# EAGLE design DIN-Rail-In_V103 (EAGLE 6.4)

## Sheet 1 of 2
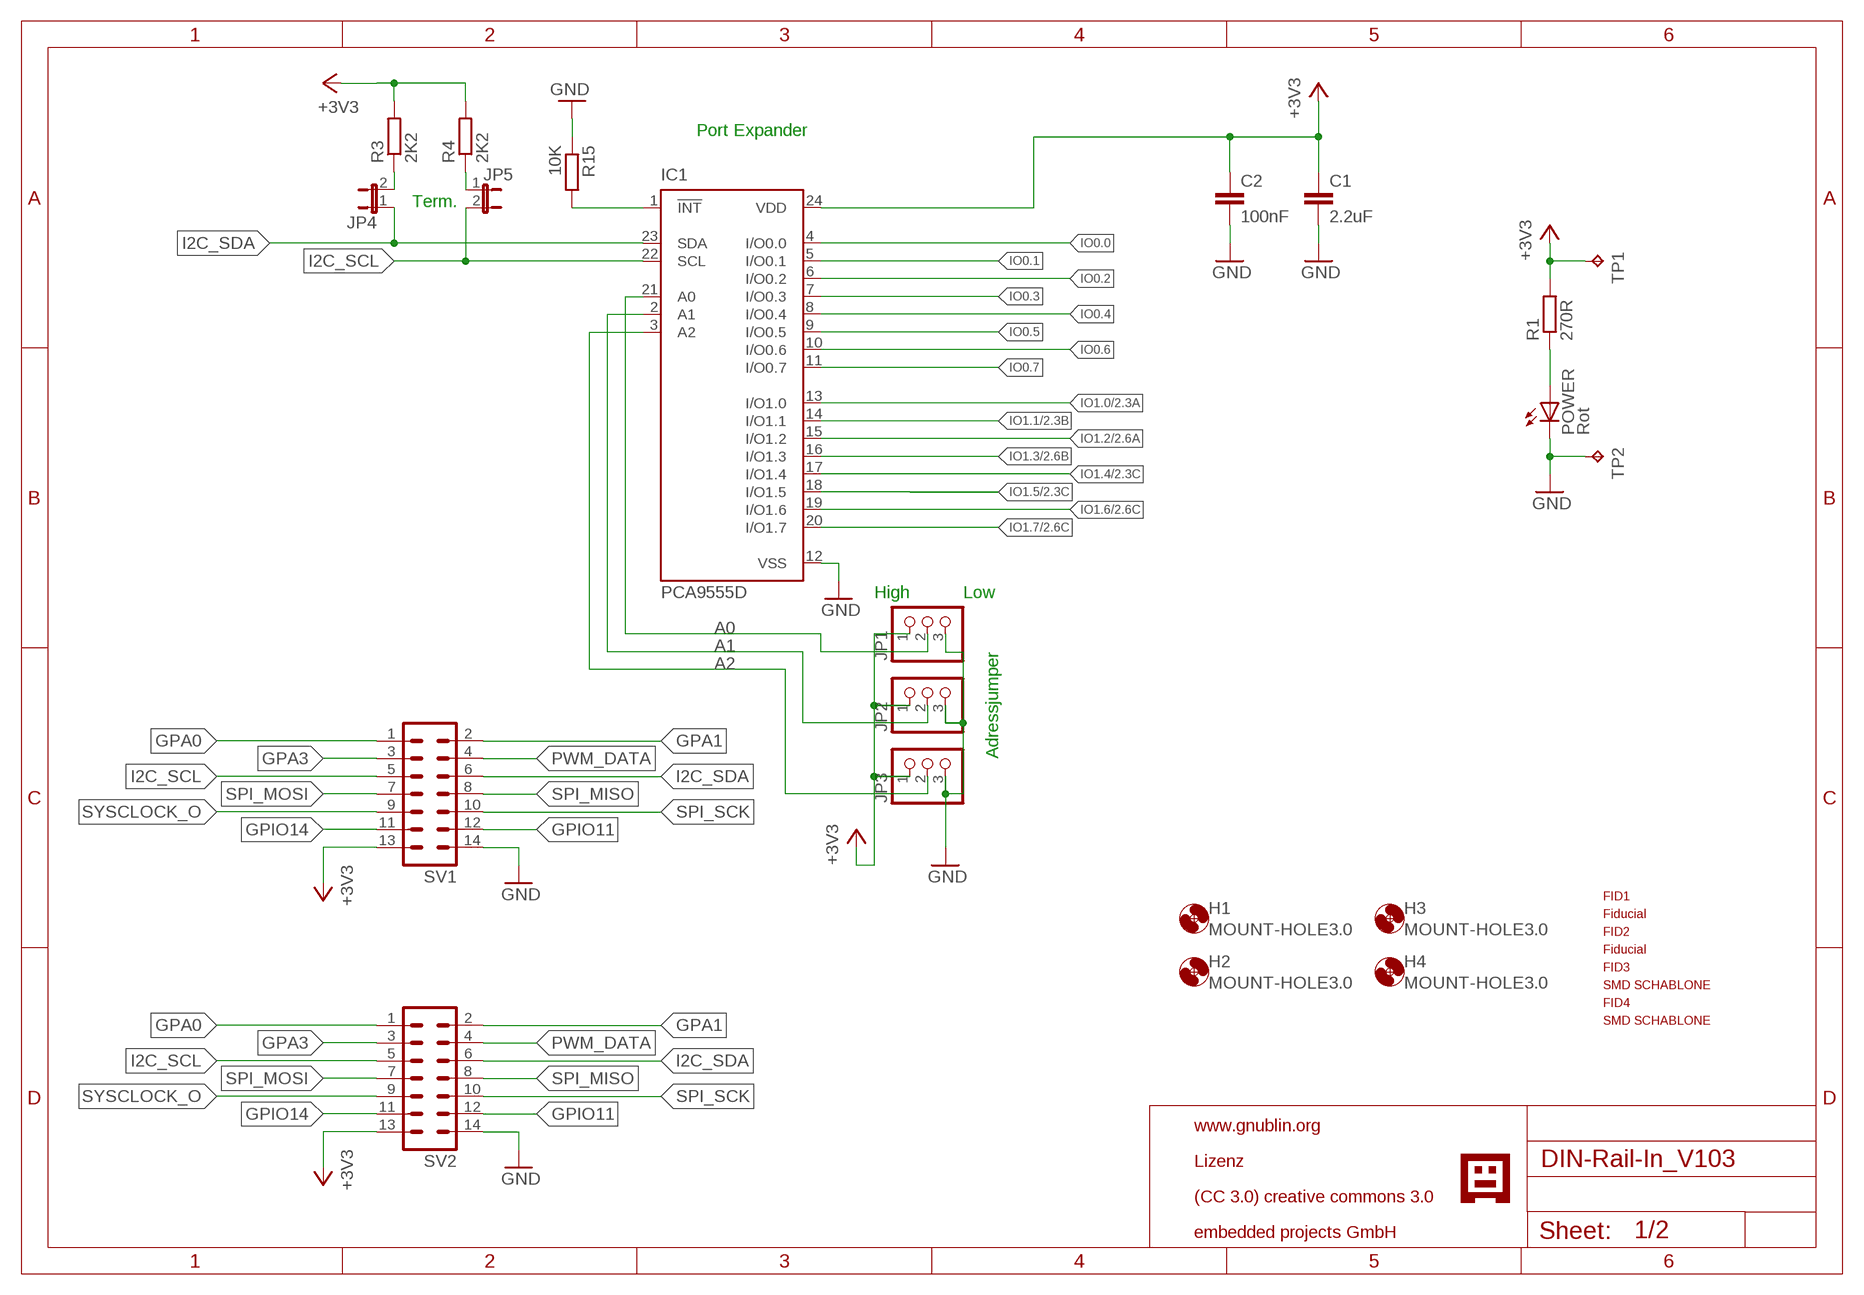
[diagram p0: schematic, sheet 1]

### Parts
C1  2.2uF  C-EUC0805  [C0805]
C2  100nF  C-EUC0805  [C0805]
FID1  PASSERMARKEN_FIDUCIAL  [PASSERMARKEN_FIDUCIAL]
FID2  PASSERMARKEN_FIDUCIAL  [PASSERMARKEN_FIDUCIAL]
FID3  PASSERMARKEN_FIDUCIAL  [PASSERMARKEN_FIDUCIAL]
FID4  PASSERMARKEN_FIDUCIAL  [PASSERMARKEN_FIDUCIAL]
H1  MOUNT-HOLE3.0  [3,0]
H2  MOUNT-HOLE3.0  [3,0]
H3  MOUNT-HOLE3.0  [3,0]
H4  MOUNT-HOLE3.0  [3,0]
IC1  PCA9555D  [SO24]
JP1  PINHD-1X3  [1X03]
JP2  PINHD-1X3  [1X03]
JP3  PINHD-1X3  [1X03]
JP4  JP1E  [JP1]
JP5  JP1E  [JP1]
POWER  Rot  LEDCHIP-LED0805  [CHIP-LED0805]
R1  270R  R-EU_R0805  [R0805]
R3  2K2  R-EU_R0805  [R0805]
R4  2K2  R-EU_R0805  [R0805]
R15  10K  R-EU_R0805  [R0805]
SV1  ML14  [ML14]
SV2  ML14  [ML14]
TP1  TPB1,27  [B1,27]
TP2  TPB1,27  [B1,27]
U$2  GNUBLINLOGOSIEB  [GNUSIEBDRUCK]

### Nets
!INT: IC1.1(!INT) R15.2
+3V3: C1.1 C2.1 IC1.24(VDD) JP1.1 JP2.1 JP3.1 R1.2 R3.2 R4.2 SV1.13 SV2.13 TP1.TP ; also sheet 2
A0: IC1.21(A0) JP1.2
A1: IC1.2(A1) JP2.2
A2: IC1.3(A2) JP3.2
GND: C1.2 C2.2 IC1.12(VSS) JP1.3 JP2.3 JP3.3 POWER.C R15.1 SV1.14 SV2.14 TP2.TP ; also sheet 2
GPA0: SV1.1 SV2.1
GPA1: SV1.2 SV2.2
GPA3: SV1.3 SV2.3
GPIO11: SV1.12 SV2.12
GPIO14: SV1.11 SV2.11
I2C_SCL: IC1.22(SCL) JP5.2 SV1.5 SV2.5
I2C_SDA: IC1.23(SDA) JP4.1 SV1.6 SV2.6
IO0.0: IC1.4(I/O0.0)
IO0.1: IC1.5(I/O0.1)
IO0.2: IC1.6(I/O0.2)
IO0.3: IC1.7(I/O0.3)
IO0.4: IC1.8(I/O0.4)
IO0.5: IC1.9(I/O0.5)
IO0.6: IC1.10(I/O0.6)
IO0.7: IC1.11(I/O0.7)
IO1.0: IC1.13(I/O1.0) ; also sheet 2
IO1.1: IC1.14(I/O1.1) ; also sheet 2
IO1.2: IC1.15(I/O1.2) ; also sheet 2
IO1.3: IC1.16(I/O1.3) ; also sheet 2
IO1.4: IC1.17(I/O1.4) ; also sheet 2
IO1.5: IC1.18(I/O1.5) ; also sheet 2
IO1.6: IC1.19(I/O1.6) ; also sheet 2
IO1.7: IC1.20(I/O1.7) ; also sheet 2
N$1: JP4.2 R3.1
N$2: POWER.A R1.1
N$5: JP5.1 R4.1
PWM_DATA: SV1.4 SV2.4
SPI_MISO: SV1.8 SV2.8
SPI_MOSI: SV1.7 SV2.7
SPI_SCK: SV1.10 SV2.10
SYSCLOCK_O: SV1.9 SV2.9

### Notes on the sheet
- Port Expander
- Term.
- High | Low
- Adressjumper
- www.gnublin.org
- Lizenz
- (CC 3.0) creative commons 3.0
- embedded projects GmbH

## Sheet 2 of 2
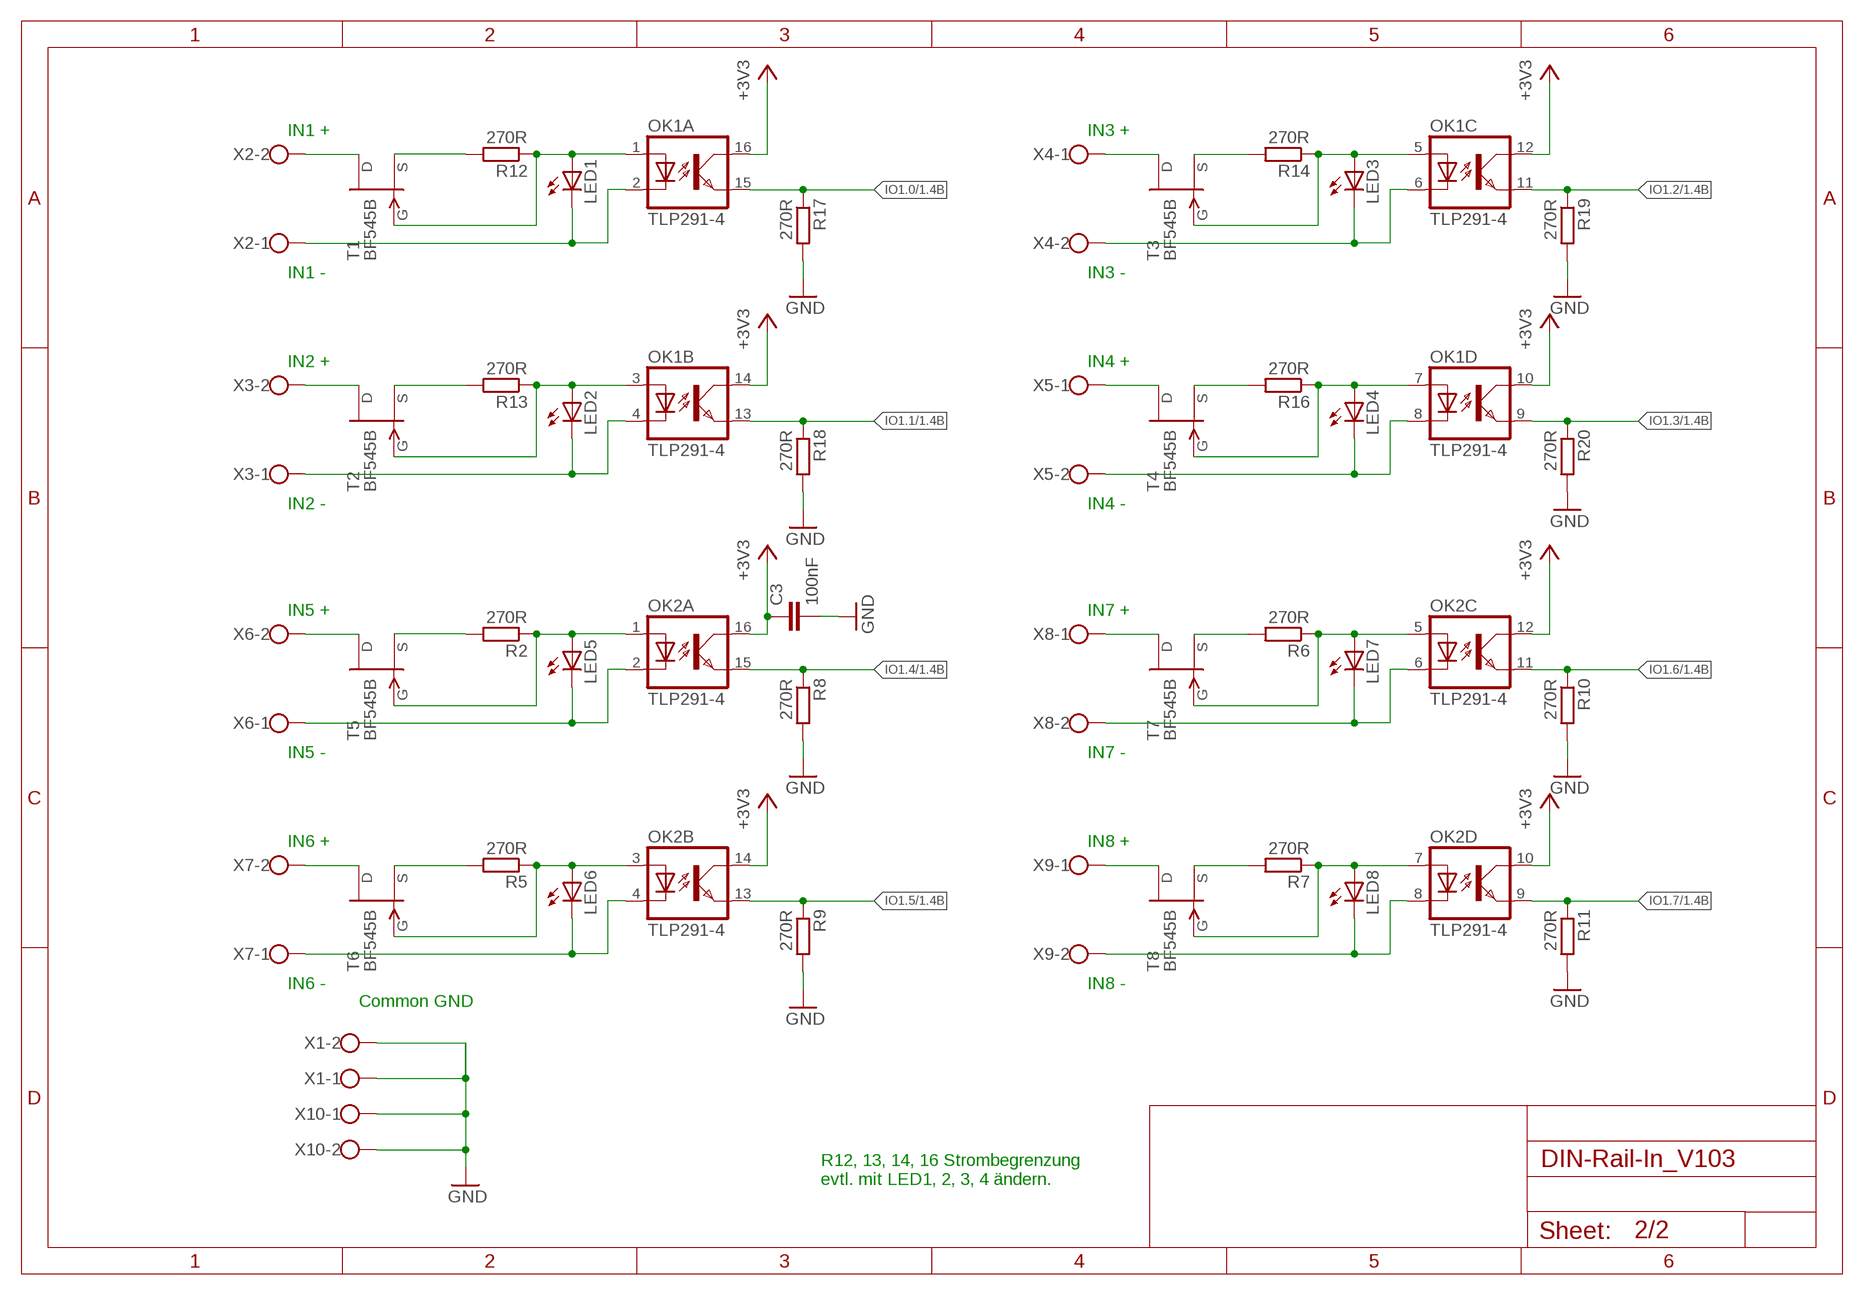
[diagram p1: schematic, sheet 2]

### Parts
C3  100nF  C-EUC0805  [C0805]
LED1  LEDCHIPLED_0805  [CHIPLED_0805]
LED2  LEDCHIPLED_0805  [CHIPLED_0805]
LED3  LEDCHIPLED_0805  [CHIPLED_0805]
LED4  LEDCHIPLED_0805  [CHIPLED_0805]
LED5  LEDCHIPLED_0805  [CHIPLED_0805]
LED6  LEDCHIPLED_0805  [CHIPLED_0805]
LED7  LEDCHIPLED_0805  [CHIPLED_0805]
LED8  LEDCHIPLED_0805  [CHIPLED_0805]
OK1  TLP291-4  TLP283-4  [MINI-FLAT-16]
OK2  TLP291-4  TLP283-4  [MINI-FLAT-16]
R2  270R  R-EU_R0805  [R0805]
R5  270R  R-EU_R0805  [R0805]
R6  270R  R-EU_R0805  [R0805]
R7  270R  R-EU_R0805  [R0805]
R8  270R  R-EU_R0805  [R0805]
R9  270R  R-EU_R0805  [R0805]
R10  270R  R-EU_R0805  [R0805]
R11  270R  R-EU_R0805  [R0805]
R12  270R  R-EU_R0805  [R0805]
R13  270R  R-EU_R0805  [R0805]
R14  270R  R-EU_R0805  [R0805]
R16  270R  R-EU_R0805  [R0805]
R17  270R  R-EU_R0805  [R0805]
R18  270R  R-EU_R0805  [R0805]
R19  270R  R-EU_R0805  [R0805]
R20  270R  R-EU_R0805  [R0805]
T1  BF545B  [SOT-23]
T2  BF545B  [SOT-23]
T3  BF545B  [SOT-23]
T4  BF545B  [SOT-23]
T5  BF545B  [SOT-23]
T6  BF545B  [SOT-23]
T7  BF545B  [SOT-23]
T8  BF545B  [SOT-23]
X1  W237-02P  [W237-132]
X2  W237-02P  [W237-132]
X3  W237-02P  [W237-132]
X4  W237-02P  [W237-132]
X5  W237-02P  [W237-132]
X6  W237-02P  [W237-132]
X7  W237-02P  [W237-132]
X8  W237-02P  [W237-132]
X9  W237-02P  [W237-132]
X10  W237-02P  [W237-132]

### Nets
+3V3: C3.1 OK1.10(D:COL) OK1.12(C:COL) OK1.14(B:COL) OK1.16(A:COL) OK2.10(D:COL) OK2.12(C:COL) OK2.14(B:COL) OK2.16(A:COL) ; also sheet 1
GND: C3.2 R8.2 R9.2 R10.2 R11.2 R17.2 R18.2 R19.2 R20.2 X1.1 X1.2 X10.1 X10.2 ; also sheet 1
IO1.0: OK1.15(A:EMIT) R17.1 ; also sheet 1
IO1.1: OK1.13(B:EMIT) R18.1 ; also sheet 1
IO1.2: OK1.11(C:EMIT) R19.1 ; also sheet 1
IO1.3: OK1.9(D:EMIT) R20.1 ; also sheet 1
IO1.4: OK2.15(A:EMIT) R8.1 ; also sheet 1
IO1.5: OK2.13(B:EMIT) R9.1 ; also sheet 1
IO1.6: OK2.11(C:EMIT) R10.1 ; also sheet 1
IO1.7: OK2.9(D:EMIT) R11.1 ; also sheet 1
N$3: T1.2(D) X2.2
N$4: LED1.A OK1.1(A:A) R12.1 T1.3(G)
N$6: T5.2(D) X6.2
N$7: T2.2(D) X3.2
N$8: LED2.A OK1.3(B:A) R13.1 T2.3(G)
N$9: LED5.A OK2.1(A:A) R2.1 T5.3(G)
N$10: LED1.C OK1.2(A:C) X2.1
N$11: T3.2(D) X4.1
N$12: LED3.A OK1.5(C:A) R14.1 T3.3(G)
N$13: T4.2(D) X5.1
N$14: LED4.A OK1.7(D:A) R16.1 T4.3(G)
N$15: T6.2(D) X7.2
N$16: LED2.C OK1.4(B:C) X3.1
N$17: LED6.A OK2.3(B:A) R5.1 T6.3(G)
N$18: LED3.C OK1.6(C:C) X4.2
N$19: LED4.C OK1.8(D:C) X5.2
N$20: R12.2 T1.1(S)
N$21: T7.2(D) X8.1
N$22: R13.2 T2.1(S)
N$23: LED7.A OK2.5(C:A) R6.1 T7.3(G)
N$24: R14.2 T3.1(S)
N$25: T8.2(D) X9.1
N$26: R16.2 T4.1(S)
N$27: LED8.A OK2.7(D:A) R7.1 T8.3(G)
N$28: LED5.C OK2.2(A:C) X6.1
N$29: LED6.C OK2.4(B:C) X7.1
N$30: LED7.C OK2.6(C:C) X8.2
N$31: LED8.C OK2.8(D:C) X9.2
N$32: R2.2 T5.1(S)
N$33: R5.2 T6.1(S)
N$34: R6.2 T7.1(S)
N$35: R7.2 T8.1(S)

### Notes on the sheet
- IN1 + | IN3 +
- IN1 - | IN3 -
- IN2 + | IN4 +
- IN2 - | IN4 -
- IN5 + | IN7 +
- IN5 - | IN7 -
- IN6 + | IN8 +
- IN6 - | IN8 -
- Common GND
- R12, 13, 14, 16 Strombegrenzung
  evtl. mit LED1, 2, 3, 4 ändern.

## Library data of the parts
C1-C3 = rcl:C-EU: CAPACITOR, European symbol
FID1 FID2 = KUBUS3:PASSERMARKEN_FIDUCIAL: SMD Passermarke
FID3 FID4 = SMDSCHABLONE:PASSERMARKEN_FIDUCIAL: SMD Passermarke
H1-H4 = holes:MOUNT-HOLE: MOUNTING HOLE with drill center marker
IC1 = micro-philips:PCA9555: 16-bit I2C and SMBus I/O port with interrupt Source: PCA9555_5.pdf; MPN: PCA9555DW; OC_FARNELL: 8906076; OC_NEWARK: 63K6067
JP1-JP3 = pinhead:PINHD-1X3: PIN HEADER
JP4 JP5 = jumper:JP1E: JUMPER
LED1-LED8 POWER = led:LED: LED OSRAM: - CHIPLED LG R971, LG N971, LY N971, LG Q971, LY Q971, LO R971, LY R971 LH N974, LH R974 LS Q976, LO Q976, LY Q976 LO Q996 - Hyper CHIPLED LW Q18S LB Q993, LB Q99A, LB R99A - SideLED LS A670, LO A670, LY A670, LG A670, LP A670 LB A673, LV A673, LT A673, LW A673 LH A674 LY A675 LS A676, LA A676, LO A676, LY A676, LW A676 LS A679, LY A679, LG A679 - Hyper Micro SIDELED® LS Y876, LA Y876, LO Y876, LY Y876 LT Y87S - SmartLED LW L88C, LW L88S LB L89C, LB L89S, LG L890 LS L89K, LO L89K, LY L89K LS L896, LA L896, LO L896, LY L896 - TOPLED LS T670, LO T670, LY T670, LG T670, LP T670 LSG T670, LSP T670, LSY T670, LOP T670, LYG T670 LG T671, LOG T671, LSG T671 LB T673, LV T673, LT T673, LW T673 LH T674 LS T676, LA T676, LO T676, LY T676, LB T676, LH T676, LSB T676, LW T676 LB T67C, LV T67C, LT T67C, LS T67K, LO T67K, LY T67K, LW E67C LS E67B, LA E67B, LO E67B, LY E67B, LB E67C, LV E67C, LT E67C LW T67C LS T679, LY T679, LG T679 LS T770, LO T770, LY T770, LG T770, LP T770 LB T773, LV T773, LT T773, LW T773 LH T774 LS E675, LA E675, LY E675, LS T675 LS T776, LA T776, LO T776, LY T776, LB T776 LHGB T686 LT T68C, LB T68C - Hyper Mini TOPLED® LB M676 - Mini TOPLED Santana® LG M470 LS M47K, LO M47K, LY M47K Source: http://www.osram.convergy.de LUXEON: - LUMILED® LXK2-PW12-R00, LXK2-PW12-S00, LXK2-PW14-U00, LXK2-PW14-V00 LXK2-PM12-R00, LXK2-PM12-S00, LXK2-PM14-U00 LXK2-PE12-Q00, LXK2-PE12-R00, LXK2-PE12-S00, LXK2-PE14-T00, LXK2-PE14-U00 LXK2-PB12-K00, LXK2-PB12-L00, LXK2-PB12-M00, LXK2-PB14-N00, LXK2-PB14-P00, LXK2-PB14-Q00 LXK2-PR12-L00, LXK2-PR12-M00, LXK2-PR14-Q00, LXK2-PR14-R00 LXK2-PD12-Q00, LXK2-PD12-R00, LXK2-PD12-S00 LXK2-PH12-R00, LXK2-PH12-S00 LXK2-PL12-P00, LXK2-PL12-Q00, LXK2-PL12-R00 Source: www.luxeon.com KINGBRIGHT: KA-3528ASYC Source: www.kingbright.com
OK1 OK2 = optocoupler:TLP283-4: TOSHIBA PHOTOCOUPLER GaAs IRED & PHOTO-TRANSISTOR Source: http://www.semicon.toshiba.co.jp/td/en/Opto/Photocoupler/en_20050928_TLP283_datasheet.pdf
R1-R20 = rcl:R-EU_: RESISTOR, European symbol
SV1 SV2 = con-ml:ML14: HARTING; OC_FARNELL: unknown; OC_NEWARK: unknown
T1-T8 = EmbeddedProjectsBauteile:BF545: JFET N-Channel; FARNELL: 1349656
TP1 TP2 = testpad:TP: Test pad
U$2 = EmbeddedProjectsLogos2:GNUBLINLOGO
X1-X10 = con-wago-508:W237-02P: WAGO SREW CLAMP

## Board
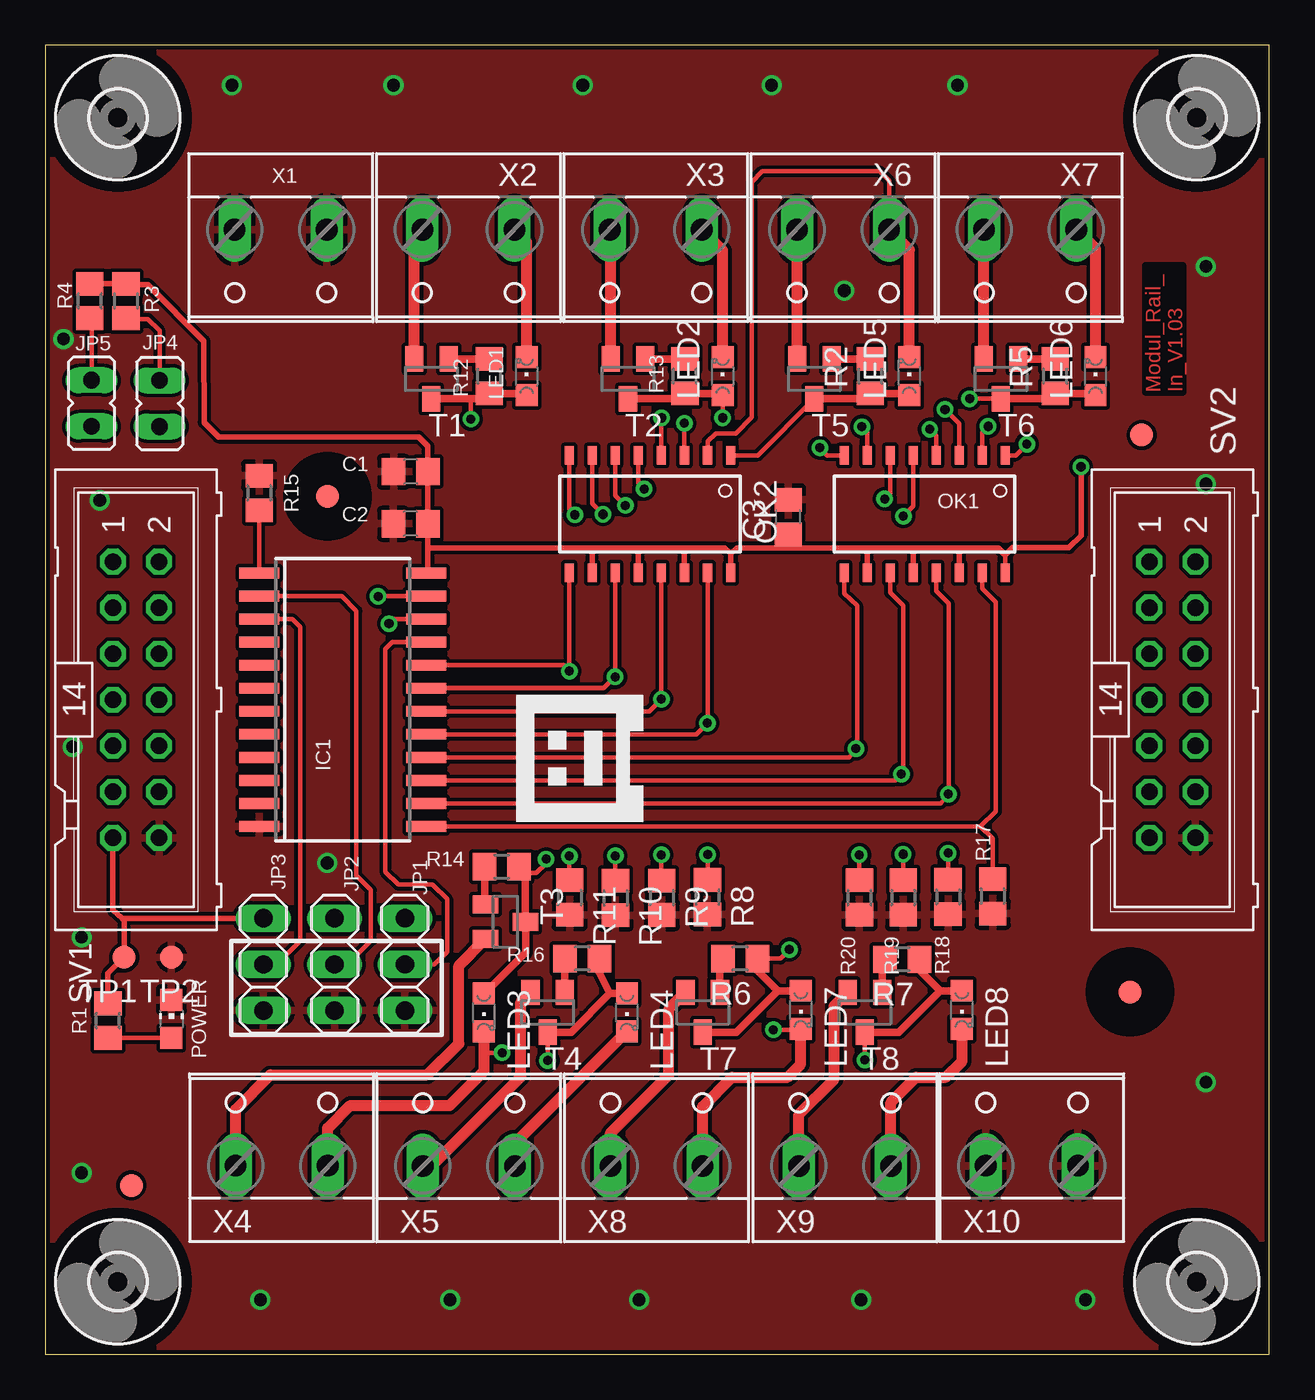
[diagram p2: board, top side]
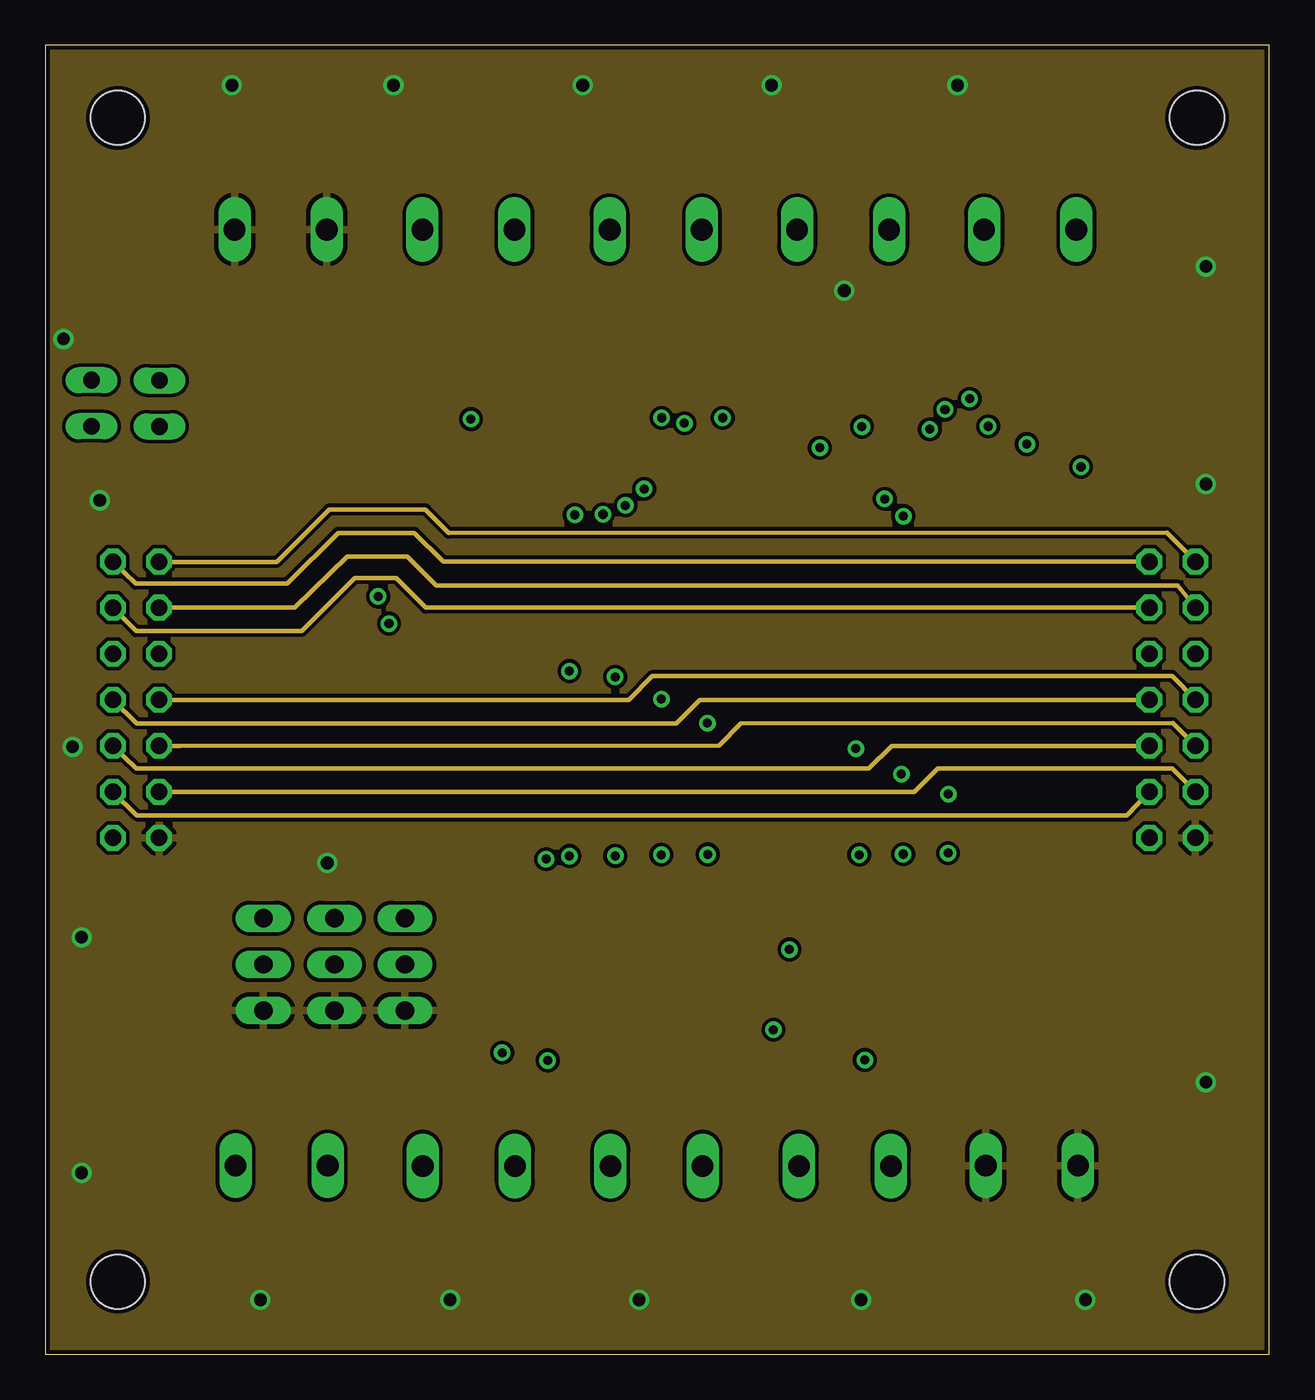
[diagram p3: board, inner layer Route2]
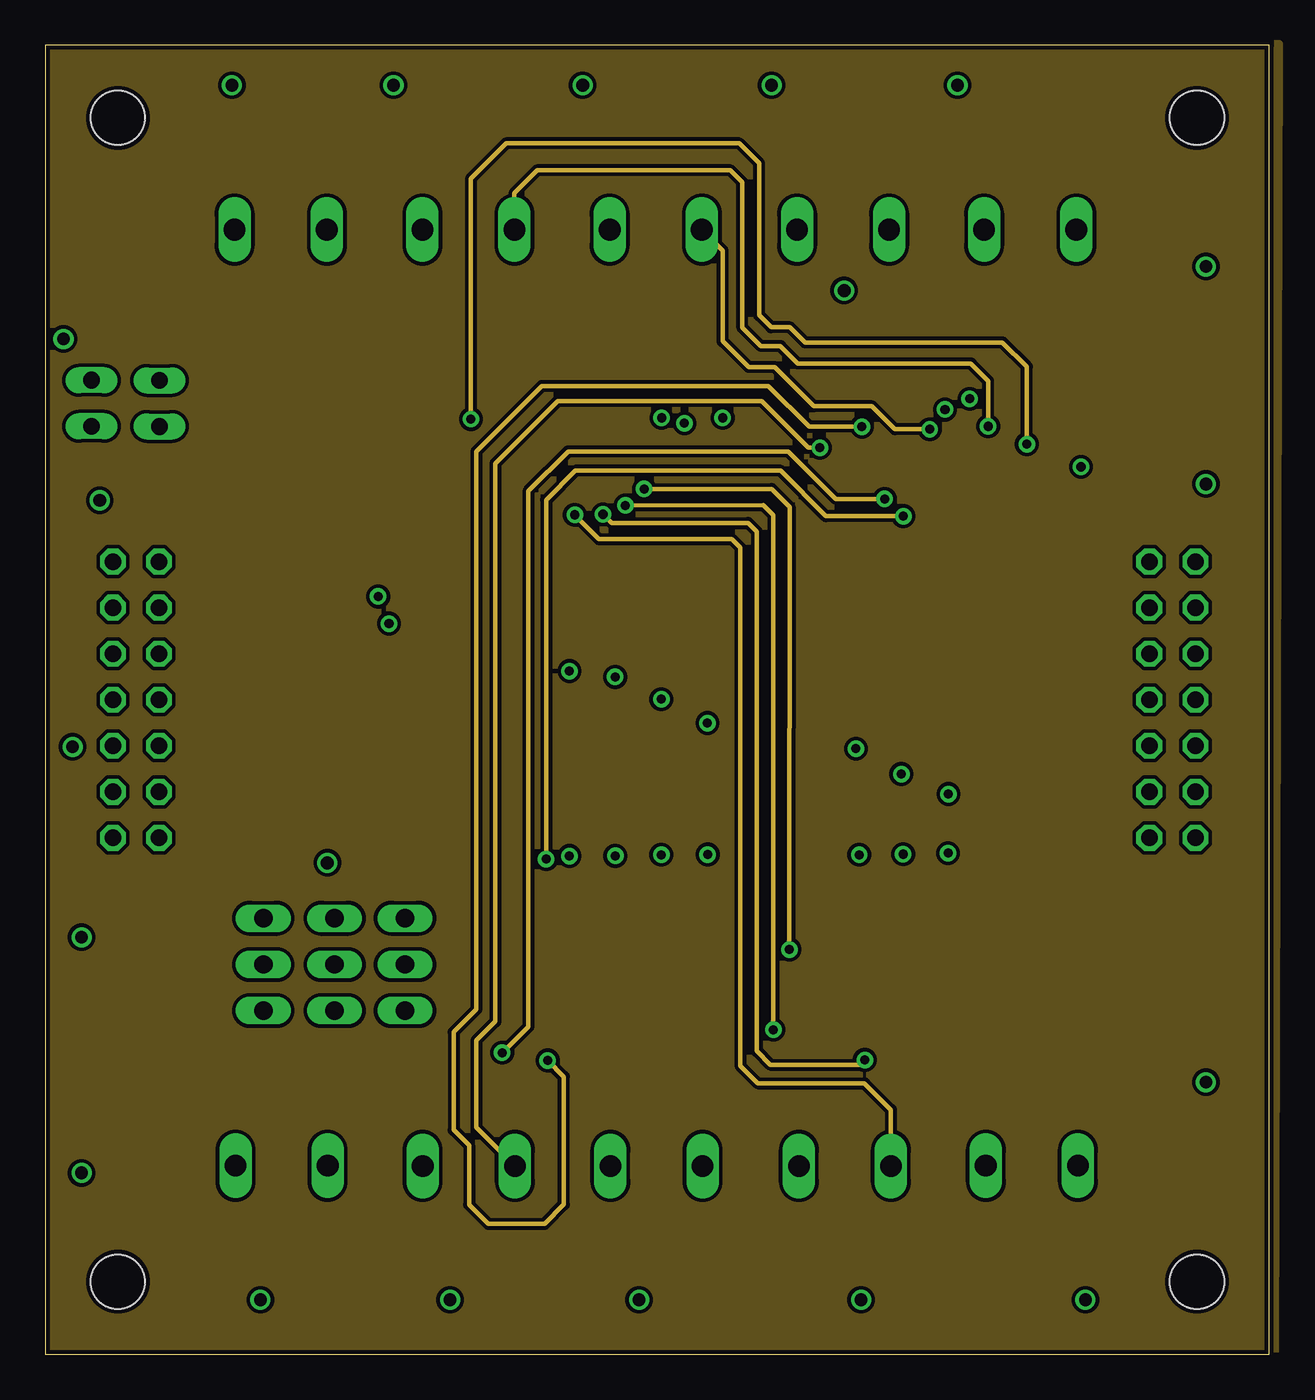
[diagram p4: board, inner layer Route15]
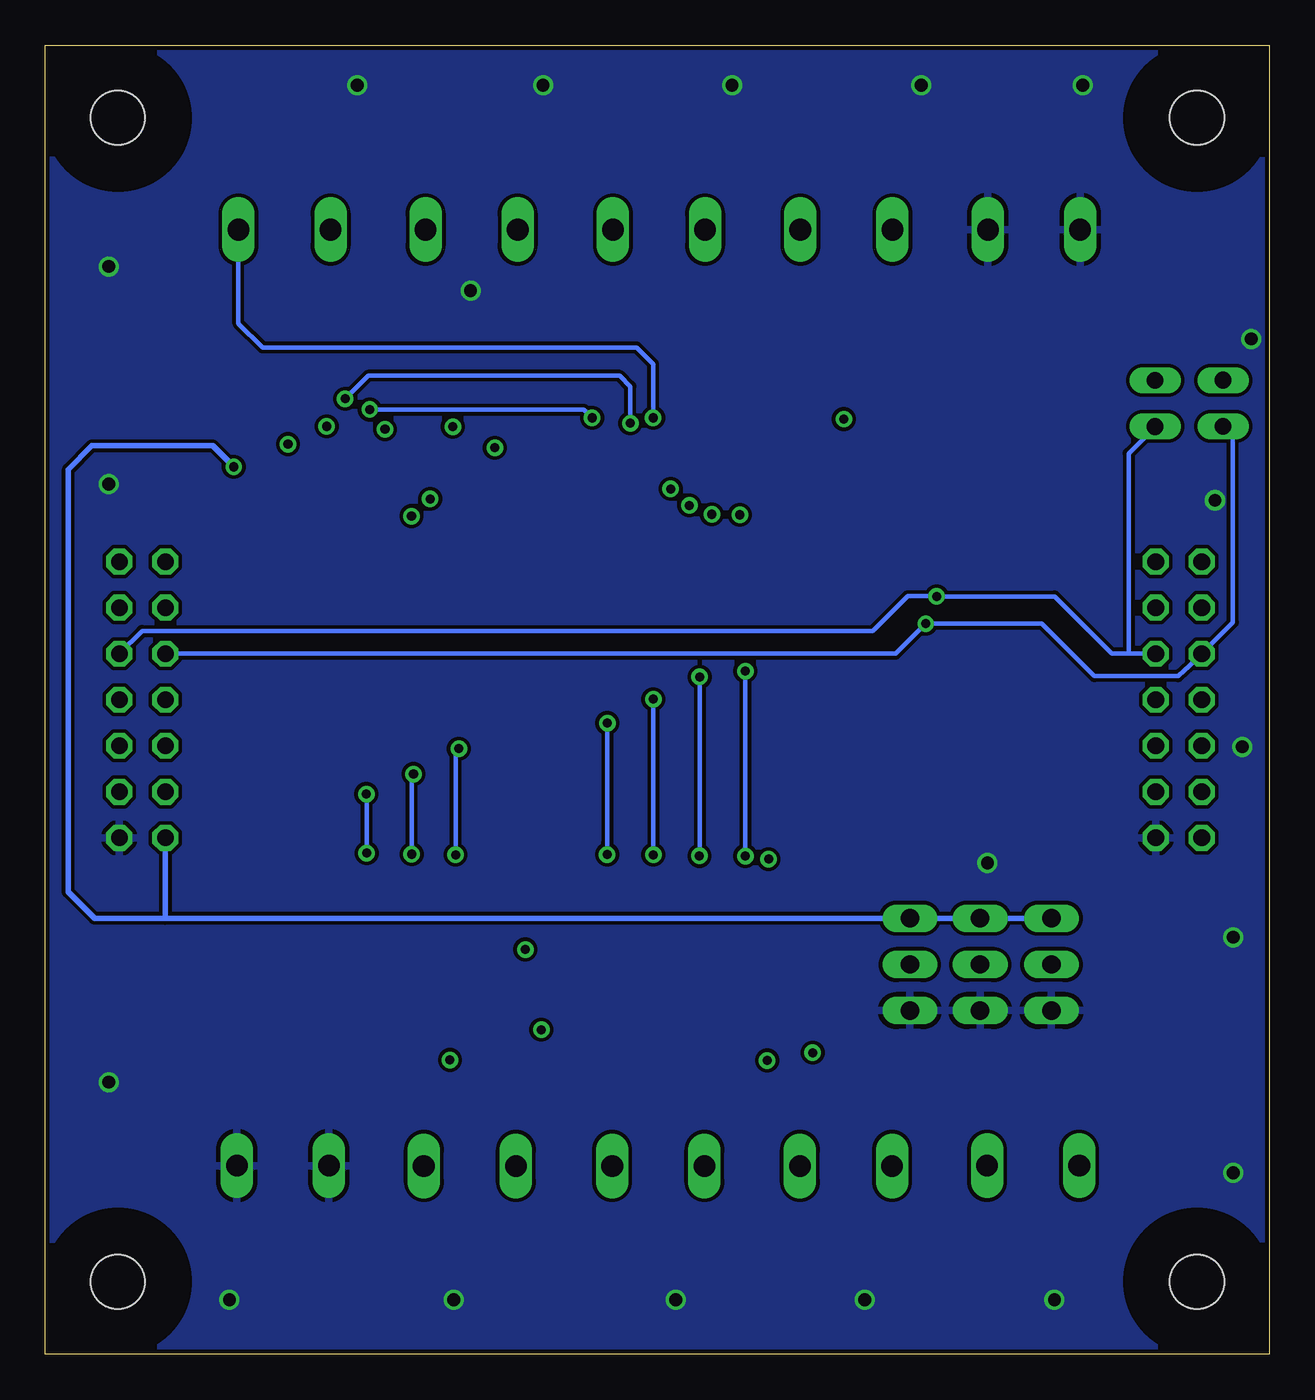
[diagram p5: board, bottom side, seen from below]

Size 67.5 x 72.2 mm. Coordinates in mm from the lower left corner, seen from the top.
Outline: 0,0 67.5,0 67.5,72.2 0,72.2 0,0
Copper layers (1*2+15*16): Top 0.035mm / dielectric 1.5mm / Route2 0.035mm / dielectric 0.15mm / Route15 0.035mm / dielectric 0.2mm / Bottom 0.035mm
Design rules "default *": minimum track width 10mil, minimum drill 24mil, track to track 8mil, track to pad 8mil, pad to pad 8mil, via to via 8mil, smd to smd 8mil, copper to edge 10mil, drill to drill 8mil, minimum pad ring 10mil, minimum via ring 8mil, stop-mask expansion 4mil, vias tented up to drill 40mil, thermal gap 10mil

### Footprints (pad centres in the part's own frame; a part is rotated, then mirrored left to right if it is on the bottom)
C0805 = smd 1.3 x 1.5: 1 -0.95,0; 2 0.95,0
PASSERMARKEN_FIDUCIAL = smd 1.27 x 1.27: 1 0,0
3,0 = hole 3: 0,0
SO24 = smd 0.6 x 2.2: 1 -6.985,-4.6; 2 -5.715,-4.6; 3 -4.445,-4.6; 4 -3.175,-4.6; 5 -1.905,-4.6; 6 -0.635,-4.6; 7 0.635,-4.6; 8 1.905,-4.6; 9 3.175,-4.6; 10 4.445,-4.6; 11 5.715,-4.6; 12 6.985,-4.6; 13 6.985,4.6; 14 5.715,4.6; 15 4.445,4.6; 16 3.175,4.6; 17 1.905,4.6; 18 0.635,4.6; 19 -0.635,4.6; 20 -1.905,4.6; 21 -3.175,4.6; 22 -4.445,4.6; 23 -5.715,4.6; 24 -6.985,4.6
1X03 = drill 1.016 long: 1 -2.54,0; 2 0,0; 3 2.54,0
JP1 = drill 0.914 long: 1 0,-1.27; 2 0,1.27
CHIPLED_0805 = smd 1.2 x 1.2: A 0,-1.05; C 0,1.05
MINI-FLAT-16 = smd 1 x 0.5: 1 -3.24,4.445; 2 -3.24,3.175; 3 -3.24,1.905; 4 -3.24,0.635; 5 -3.24,-0.635; 6 -3.24,-1.905; 7 -3.24,-3.175; 8 -3.24,-4.445; 9 3.24,-4.445; 10 3.24,-3.175; 11 3.24,-1.905; 12 3.24,-0.635; 13 3.24,0.635; 14 3.24,1.905; 15 3.24,3.175; 16 3.24,4.445
CHIP-LED0805 = smd 1.2 x 1.2: A 0,-1.05; C 0,1.05
R0805 = smd 1.3 x 1.5: 1 -0.95,0; 2 0.95,0
ML14 = drill 0.914 octagon: 1 -7.62,-1.27; 2 -7.62,1.27; 3 -5.08,-1.27; 4 -5.08,1.27; 5 -2.54,-1.27; 6 -2.54,1.27; 7 0,-1.27; 8 0,1.27; 9 2.54,-1.27; 10 2.54,1.27; 11 5.08,-1.27; 12 5.08,1.27; 13 7.62,-1.27; 14 7.62,1.27
SOT-23 = smd 1 x 1.4: 1 -0.95,-1.1; 2 0.95,-1.1; 3 0,1.1
B1,27 = smd 1.27 x 1.27: TP 0,0
W237-132 = drill 1.194 long: 1 -2.54,-0.635; 2 2.54,-0.635

### Placement (x,y rotation side)
C1  20.15,48.68 180 top
C2  20.14,45.81 180 top
C3  40.96,46.18 90 top
FID1  15.56,47.32 0 top
FID2  59.81,19.98 0 top
FID3  60.45,50.7 0 top
FID4  4.74,9.31 0 top
H1  4,4 0 top
H2  63.5,4 0 top
H3  63.5,68.2 0 top
H4  4,68.2 0 top
IC1  16.4,36.1 270 top
JP1  19.83,21.5 270 top
JP2  15.95,21.5 270 top
JP3  12.02,21.5 270 top
JP4  6.3,52.44 0 top
JP5  2.55,52.46 180 top
LED1  26.54,53.95 0 top
LED2  37.35,53.95 0 top
LED3  24.18,18.85 180 top
LED4  32.07,18.85 180 top
LED5  47.64,53.95 0 top
LED6  57.91,53.95 0 top
LED7  41.66,19 180 top
LED8  50.54,19 180 top
OK1  48.49,46.34 270 top
OK2  33.34,46.34 270 top
POWER  6.95,18.5 0 top
R1  3.45,18.4 90 top
R2  45.49,53.95 90 top
R3  4.45,58.1 90 top
R4  2.45,58.1 90 top
R5  55.69,53.95 90 top
R6  38.31,21.82 180 top
R7  47.25,21.78 180 top
R8  36.51,25.21 270 top
R9  33.99,25.18 270 top
R10  31.44,25.16 270 top
R11  28.91,25.19 270 top
R12  24.48,53.95 90 top
R13  35.27,53.95 90 top
R14  25.17,26.89 180 top
R15  11.79,47.51 270 top
R16  29.61,21.82 180 top
R17  52.24,25.26 270 top
R18  49.78,25.22 270 top
R19  47.3,25.19 270 top
R20  44.89,25.19 270 top
SV1  5,36.1 270 top
SV2  62.15,36.1 270 top
T1  21.29,53.8 180 top
T2  32.13,53.8 180 top
T3  25.37,23.85 270 top
T4  27.7,18.86 180 top
T5  42.41,53.8 180 top
T6  52.69,53.8 180 top
T7  36.25,18.86 180 top
T8  45.19,18.86 180 top
TP1  4.35,21.9 0 top
TP2  6.95,21.9 0 top
U$2  32.97,29.37 90 top
X1  12.98,61.4 180 top
X2  23.33,61.4 180 top
X3  33.66,61.4 180 top
X4  13.03,11.03 0 top
X5  23.35,11.02 0 top
X6  43.99,61.4 180 top
X7  54.31,61.4 180 top
X8  33.7,11.02 0 top
X9  44.09,11.02 0 top
X10  54.4,11.03 0 top

### Tracks (layer width: path | path; a pad name or v marks a point on that pad's centre or on a via)
!INT
  Top 0.254: IC1.1 R15.2
+3V3  (via drill 0.5)
  Top 0.254: 47.85,44.41 47.84,44.48 | 50.4,44.41 50.4,44.48 | 52.94,44.09 OK1.16 | 45.31,43.95 45.31,44 | 30.18,44.48 30.16,44.47 OK2.10 | 32.7,44.45 32.67,44.48 | 35.24,44.45 35.29,44.48 | 21.18,44.48 21.09,44.39 | 41,44.61 40.87,44.48 | 45.32,44.48 45.31,44.14 45.32,44.48
  Top 0.305: C1.1 21.1,46.4 C2.1 21.09,44.39 21.09,43.12 IC1.24 | 8.74,55.79 8.74,55.89 | 8.74,55.89 8.74,55.79 | 8.74,55.79 8.75,51.4 9.55,50.6 20.59,50.6 21.1,50.09 C1.1 | 21.11,48.72 C1.1 | JP3.1 4.25,24.04 | 4.25,24.04 4.23,24.05 3.73,24.52 3.73,24.97 SV1.13 | R1.2 3.45,21 TP1.TP 4.35,23.94 4.25,24.04 | 45.32,44.48 47.84,44.48 50.4,44.48 52.55,44.48 52.94,44.09 53.33,44.49 56.44,44.49 57.11,45.16 v57.11,48.95 | OK1.10 45.31,43.95 45.31,44.14 | 47.85,44.41 OK1.12 | 50.4,44.41 OK1.14 | 45.31,44 45.32,44.48 | 8.74,55.79 8.74,55.89 | 8.74,55.89 5.64,59 4.5,59 R3.2 R4.2 | OK2.16 37.78,44.17 | 37.78,44.17 37.47,44.48 35.29,44.48 32.67,44.48 30.18,44.48 | OK2.12 32.7,44.45 | OK2.14 35.24,44.45 | OK2.10 30.16,44.48 21.18,44.48 | 45.32,44.48 40.87,44.48 38.13,44.48 37.78,44.17 | C3.1 41,44.61
  Bottom 0.305: SV2.13 60.89,28.43 60.89,24.04 | JP3.1 JP2.1 JP1.1 60.89,24.04 | 60.89,24.04 60.92,24.04 60.89,24.04 | 60.89,24.04 64.78,24.04 66.24,25.5 66.24,27.12 66.23,48.81 64.93,50.11 58.27,50.11 v57.11,48.95
A0
  Top 0.254: IC1.21 19.12,39.27 18.75,38.9 18.75,26.6 19.45,25.9 21.34,25.9 22.15,25.1 22.15,22.2 21.45,21.5 JP1.2
A1
  Top 0.254: IC1.2 16.34,41.81 17.15,41 17.15,26.4 17.95,25.6 17.95,22.8 16.65,21.5 JP2.2
A2
  Top 0.254: JP3.2 12.75,21.5 14.05,22.8 14.05,40.1 13.85,40.3 13.61,40.55 IC1.3
GND  (via drill 0.7)
  other vias: 2,23 1.5,33.5 1,56 3,47.1 2,10 11.86,3 22.32,3 32.74,3 64,48 10.29,70 19.2,70 29.63,70 15.55,27.1 40.05,70 50.3,70 64,60 44.98,3 57.35,3 64,15 44.05,58.67
  pour Bottom: -2.7,-3.6 71.13,-4.04 70.13,74.86 -3.7,75.3
  pour Top: -2.7,-3.3 70.87,-4.29 70.27,73.71 -3.3,74.7
  pour Route2: -0.67,72.56 67.64,72.46 67.83,-0.32 -0.48,-0.22
GNDA
  pour Route15: 0.2,72.33 68.05,72.3 67.81,-0.29 -0.04,-0.26
GPA0
  Route2 0.254: SV2.1 21.93,43.72 20.35,45.3 16.15,45.3 13.35,42.5 4.98,42.5 SV1.1
GPA1
  Route2 0.254: SV2.2 63.4,43.74 61.83,45.31 22.25,45.3 20.95,46.6 15.65,46.6 12.75,43.7 6.05,43.7 SV1.2
GPA3
  Route2 0.254: SV2.3 20.97,41.18 19.35,42.8 17.05,42.8 14.15,39.9 5.01,39.89 SV1.3
GPIO11
  Route2 0.254: SV2.12 62.15,32.3 49.2,32.3 47.92,31.02 SV1.12
GPIO14
  Route2 0.254: SV1.11 5.05,29.73 59.63,29.73 SV2.11
I2C_SCL  (via drill 0.5)
  Top 0.254: IC1.22 19.2,40.55 v18.95,40.3
  Bottom 0.254: JP5.2 2.02,50.68 2.01,40.36 SV1.5 3.77,38.56 5.04,37.4 9.65,37.4 9.85,37.6 12.55,40.3 v18.95,40.3 20.61,38.64 SV2.5
I2C_SDA  (via drill 0.5)
  Top 0.254: IC1.23 18.36,41.81 v18.35,41.8
  Bottom 0.254: SV1.6 6.35,38.64 7.76,38.64 | 7.76,38.64 8.69,38.64 8.95,38.9 11.85,41.8 v18.35,41.8 18.36,41.81 19.95,41.81 21.86,39.9 62.16,39.9 SV2.6 | JP4.1 6.3,51.15 7.76,49.68 7.76,38.64
IO1.0
  Top 0.254: OK1.15 51.67,42.24 52.42,41.5 52.42,29.93 51.56,29.11 | IC1.13 51.52,29.11 51.56,29.11 | R17.1 52.24,28.44 51.56,29.11
IO1.1  (via drill 0.5)
  Top 0.254: IC1.14 49.38,30.39 v49.8,30.9 49.81,30.96 49.81,41.41 49.12,42.09 OK1.13 | R18.1 v49.78,27.64
  Bottom 0.254: v49.78,27.64 49.78,30.88 v49.8,30.9
IO1.2  (via drill 0.5)
  Top 0.254: IC1.15 46.85,31.66 v47.2,32 47.31,32.1 47.31,41.31 46.59,42.01 OK1.11 | R19.1 v47.3,27.58
  Bottom 0.254: v47.3,27.58 47.3,31.9 v47.2,32
IO1.3  (via drill 0.5)
  Top 0.254: IC1.16 44.33,32.92 v44.7,33.4 44.76,33.45 44.76,41.29 44.05,41.97 OK1.9 | R20.1 44.87,27.11 v44.88,27.55
  Bottom 0.254: v44.88,27.55 44.88,33.22 v44.7,33.4
IO1.4  (via drill 0.5)
  Top 0.254: IC1.17 35.9,34.2 v36.51,34.81 v36.52,34.81 OK2.15 | R8.1 36.52,27.43 v36.52,27.56
  Bottom 0.254: v36.51,34.81 36.51,28.29 v36.52,27.56
IO1.5  (via drill 0.5)
  Top 0.254: IC1.18 33.3,35.47 v33.97,36.13 v33.98,36.13 OK2.13 | v33.97,27.55 33.97,26.27 R9.1
  Bottom 0.254: v33.97,36.13 v33.97,27.55
IO1.6  (via drill 0.5)
  Top 0.254: IC1.19 30.8,36.73 v31.42,37.36 31.43,37.38 OK2.11 | v31.43,27.49 31.43,26.24 R10.1
  Bottom 0.254: v31.42,37.36 31.42,27.71 v31.43,27.49
IO1.7  (via drill 0.5)
  Top 0.254: IC1.20 28.57,38.01 v28.9,37.68 v28.89,37.69 OK2.9 | v28.9,27.48 28.9,26.29 R11.1
  Bottom 0.254: v28.9,37.68 v28.9,27.48
N$1
  Top 0.254: JP4.2 6.3,56.45 5.65,57.1 4.5,57.1 R3.1
N$2
  Top 0.254: R1.1 POWER.A
N$3
  Top 0.61: T1.2 20.34,61.59 X2.2
N$4  (via drill 0.5)
  Top 0.254: OK1.1 53.5,49.58 v54.12,50.2 | v23.47,51.58 23.47,52.7
  Top 0.406: T1.3 23.47,52.7 24.74,52.7 25.02,52.98 24.5,52.98 R12.1 26.44,53 LED1.A
  Route15 0.254: v54.12,50.2 54.12,54.47 52.78,55.81 41.9,55.81 41.06,56.65 40.02,56.65 39.36,57.31 39.36,65.69 38.26,66.79 25.41,66.79 23.46,64.84 v23.46,51.59 v23.47,51.58
N$5
  Top 0.254: JP5.1 2.55,56.92 R4.1
N$6
  Top 0.61: T5.2 X6.2
N$7
  Top 0.61: T2.2 31.18,61.98 X3.2
N$8  (via drill 0.5)
  Top 0.254: OK1.3 50.4,51.33 v49.61,52.11 | v37.35,51.65 LED2.A
  Top 0.406: T2.3 34.97,52.7 R13.1 37.25,53 LED2.A
  Bottom 0.254: v49.61,52.11 37.81,52.1 v37.35,51.65
N$9
  Top 0.254: OK2.1 39.29,49.58 T5.3
  Top 0.406: T5.3 45.19,52.7 R2.1 47.54,53 LED5.A
N$10  (via drill 0.5)
  Top 0.254: OK1.2 51.66,50.85 v51.99,51.18
  Top 0.61: LED1.C 26.54,61.37 X2.1
  Route15 0.254: v51.99,51.18 51.99,53.69 51.03,54.65 41.49,54.65 40.53,55.61 39.45,55.61 38.44,56.62 38.44,64.64 37.78,65.3 27.12,65.3 25.86,64.04 25.86,62.05 X2.1
N$11
  Top 0.61: X4.1 10.49,13.49 12.41,15.41 21.07,15.41 22.8,17.13 22.8,21.42 T3.2
N$12  (via drill 0.5)
  Top 0.254: OK1.5 47.85,46.77 v47.31,46.23 | v27.62,27.31 27.62,27.08 27.08,26.54 26.47,26.54
  Top 0.406: R14.1 26.47,26.54 T3.3 26.48,22.16 24.22,19.9 LED3.A
  Route15 0.254: v47.31,46.23 43.04,46.23 40.54,48.73 29.23,48.73 27.62,47.12 v27.62,27.31
N$13
  Top 0.61: X5.1 21.3,10.38 26.22,15.3 26.22,19.43 T4.2
N$14  (via drill 0.5)
  Top 0.254: OK1.7 45.31,50.88 v45.03,51.16 | v27.7,16.2 T4.3
  Top 0.406: T4.3 28.99,17.76 31.13,19.9 | 31.13,19.9 LED4.A | R16.1 30.55,21.06 31.13,19.9
  Route15 0.254: v45.03,51.16 42.12,51.16 39.87,53.41 27.38,53.41 23.77,49.8 23.77,19.02 22.52,17.77 22.52,12.37 23.37,11.52 23.37,8.25 24.43,7.19 27.53,7.19 28.6,8.26 28.6,15.3 v27.7,16.2
N$15
  Top 0.61: T6.2 51.74,62.01 X7.2
N$16  (via drill 0.5)
  Top 0.254: OK1.4 49.12,50.66 v48.77,51.02
  Top 0.61: LED2.C 37.35,60.88 X3.1
  Route15 0.254: v48.77,51.02 46.85,51.02 45.58,52.29 42.38,52.29 40.22,54.45 38.78,54.45 37.35,55.88 37.35,60.88 X3.1
N$17  (via drill 0.5)
  Top 0.254: OK2.3 v35.24,51.34 v35.24,51.35 | v50.97,52.7 T6.3
  Top 0.406: T6.3 55.39,52.7 R5.1 57.81,53 LED6.A
  Bottom 0.254: v35.24,51.35 35.24,53.38 35.83,53.97 49.7,53.97 v50.97,52.7
N$18  (via drill 0.5)
  Top 0.254: OK1.6 46.59,47.48 v46.28,47.18 | v25.19,16.63 24.22,16.63 24.19,16.66
  Top 0.61: X4.2 15.57,12.47 16.82,13.72 22.29,13.72 24.19,15.62 24.19,16.66 LED3.C
  Route15 0.254: v46.28,47.18 43.59,47.18 40.97,49.8 28.83,49.8 26.63,47.6 26.63,18.06 26.62,18.06 v25.19,16.63
N$19  (via drill 0.5)
  Top 0.254: OK1.8 43.13,49.58 v42.71,50
  Top 0.61: X5.2 25.89,11.62 LED4.C
  Route15 0.254: v42.71,50 42.07,50 39.5,52.57 28.25,52.57 24.82,49.14 24.82,18.35 23.77,17.3 23.77,12.51 X5.2
N$20
  Top 0.406: T1.1 R12.2
N$21
  Top 0.61: X8.1 31.16,12.19 34.38,15.41 34.38,19.04 T7.2
N$22
  Top 0.406: T2.1 R13.2
N$23  (via drill 0.5)
  Top 0.254: OK2.5 32.7,48.05 v33.02,47.73 | v41.03,22.32 v41.03,22.31 40.55,21.83 R6.1
  Top 0.406: T7.3 38.1,17.76 40.39,20.05 | 40.39,20.05 LED7.A | R6.1 39.26,21.18 40.39,20.05
  Route15 0.254: v33.02,47.73 40.05,47.73 41.04,46.74 v41.03,22.32
N$24
  Top 0.406: R14.2 24.22,24.85 T3.1
N$25
  Top 0.61: X9.1 41.55,13.22 43.49,15.16 43.49,19.21 T8.2
N$26
  Top 0.406: T4.1 R16.2
N$27  (via drill 0.5)
  Top 0.254: OK2.7 30.16,46.91 v30.75,46.33 | v45.19,16.23 T8.3
  Top 0.406: T8.3 47.06,17.76 49.34,20.04 | 49.34,20.04 LED8.A | R7.1 48.19,21.19 49.34,20.04
  Route15 0.254: v30.75,46.33 31.22,45.86 38.75,45.86 39.22,45.39 39.22,16.73 39.98,15.97 44.93,15.97 v45.19,16.23
N$28
  Top 0.254: OK2.2 36.52,50.35 36.96,50.79 38.07,50.79 38.96,51.68 38.94,64.65 39.54,65.25 46.01,65.25 46.53,64.73 X6.1
  Top 0.61: LED5.C 47.64,60.92 X6.1
N$29  (via drill 0.5)
  Top 0.254: OK2.4 v33.98,51.65
  Top 0.61: LED6.C 57.91,60.98 X7.1
  Bottom 0.254: v33.98,51.65 33.98,54.62 34.89,55.53 55.52,55.53 56.85,56.86 X7.1
N$30  (via drill 0.5)
  Top 0.254: OK2.6 31.43,47.38 v31.99,46.82 | v40.15,17.9 41.61,17.9 LED7.C
  Top 0.61: X8.2 36.24,13.65 37.86,15.27 40.93,15.27 41.65,15.99 LED7.C
  Route15 0.254: v31.99,46.82 39.6,46.83 40.15,46.28 v40.15,17.9
N$31  (via drill 0.5)
  Top 0.254: OK2.8 28.89,46.6 v29.2,46.3
  Top 0.61: X9.2 46.63,13.89 48.01,15.27 49.66,15.28 50.56,16.16 50.56,17.93 LED8.C
  Route15 0.254: v29.2,46.3 v29.2,46.29 30.53,44.96 37.85,44.96 38.32,44.49 38.32,15.91 39.29,14.94 45.17,14.94 46.63,13.48 X9.2
N$32
  Top 0.406: T5.1 R2.2
N$33
  Top 0.406: T6.1 R5.2
N$34
  Top 0.406: T7.1 37.2,21.66 R6.2
N$35
  Top 0.406: T8.1 46.14,21.62 R7.2
PWM_DATA
  Route2 0.254: SV2.4 62.45,42.4 21.55,42.4 19.95,44 16.65,44 13.75,41.2 6.06,41.2 SV1.4
SPI_MISO
  Route2 0.254: SV2.8 63.41,36.12 62.14,37.41 33.46,37.4 32.16,36.1 SV1.8
SPI_MOSI
  Route2 0.254: SV2.7 36.08,36.1 34.78,34.8 5.04,34.8 SV1.7
SPI_SCK
  Route2 0.254: SV2.10 62.17,34.81 38.36,34.79 37.15,33.57 7.45,33.56 SV1.10
SYSCLOCK_O
  Route2 0.254: SV1.9 5.01,32.32 45.4,32.3 46.66,33.56 SV2.9

### Text on the board
Top: Modul_Rail_ / In_V1.03
Document: = UMK-BE 45
tDocu: Common / GND | <VCC1 | <GND1 | <VCC2 | <GND2 | <VCC5 | <GND5 | <VCC6 | <GND6 | SCL | SDA | I2C-Pullups | RAIL / INPUT 8 | www.gnublin.org | High | Low | A2 | A1 | A0 | VCC3> | GND3> | VCC4> | GND4> | VCC7> | GND7> | VCC8> | GND8> | Common / GND